# EAGLE design ArduBridge_V1_Alpha (EAGLE 6.4)
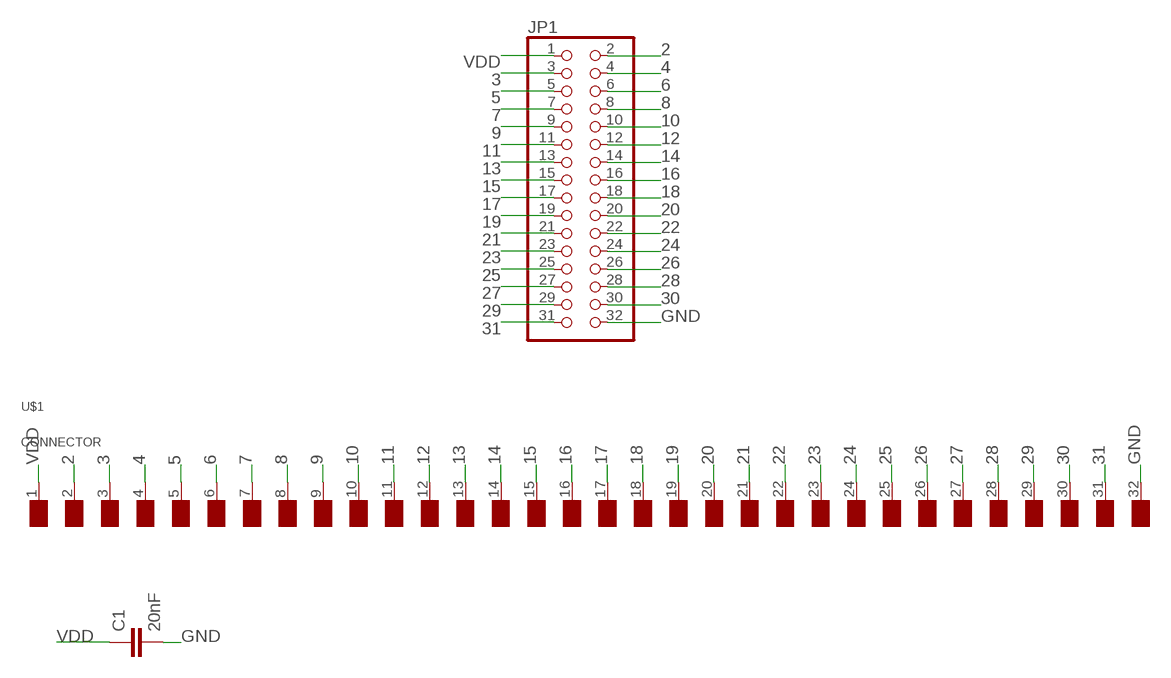
[diagram p0: schematic, sheet 1]

## Parts
C1  20nF  C-EUC0805  [C0805]
JP1  PINHD-2X16/90  [2X16/90]
U$1  CONNECTOR  [CONNECTOR]

## Nets
2: JP1.2 U$1.2(NC)
3: JP1.3 U$1.3(/WR)
4: JP1.4 U$1.4(/RD)
5: JP1.5 U$1.5(/RCS)
6: JP1.6 U$1.6(A0)
7: JP1.7 U$1.7(A1)
8: JP1.8 U$1.8(A2)
9: JP1.9 U$1.9(A3)
10: JP1.10 U$1.10(A4)
11: JP1.11 U$1.11(A5)
12: JP1.12 U$1.12(A6)
13: JP1.13 U$1.13(A7)
14: JP1.14 U$1.14(A8)
15: JP1.15 U$1.15(A9)
16: JP1.16 U$1.16(A10)
17: JP1.17 U$1.17(A11)
18: JP1.18 U$1.18(A12)
19: JP1.19 U$1.19(A13)
20: JP1.20 U$1.20(A14)
21: JP1.21 U$1.21(A15)
22: JP1.22 U$1.22(D0)
23: JP1.23 U$1.23(D1)
24: JP1.24 U$1.24(D2)
25: JP1.25 U$1.25(D3)
26: JP1.26 U$1.26(D4)
27: JP1.27 U$1.27(D5)
28: JP1.28 U$1.28(D6)
29: JP1.29 U$1.29(D7)
30: JP1.30 U$1.30(/RS)
31: JP1.31 U$1.31(VIN)
GND: C1.2 JP1.32 U$1.32(GND)
VDD: C1.1 JP1.1 U$1.1(VDD)

## Library data of the parts
C1 = resistor:C-EU: CAPACITOR, European symbol
JP1 = pinhead:PINHD-2X16: PIN HEADER
U$1 = gameboy:CONNECTOR: Connector Pads for Gameboy Cartridges

## Board
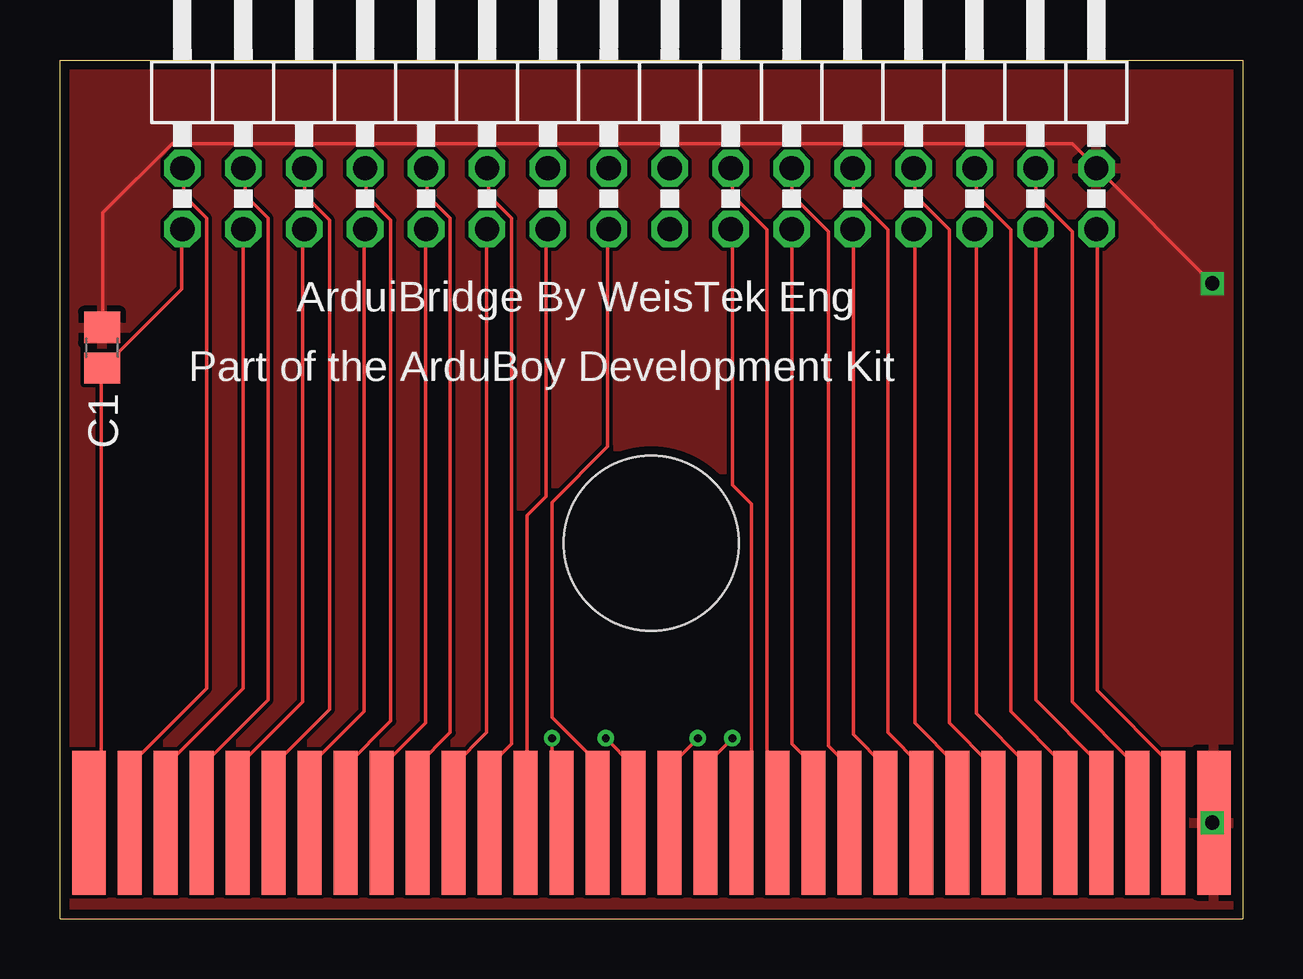
[diagram p1: board, top side]
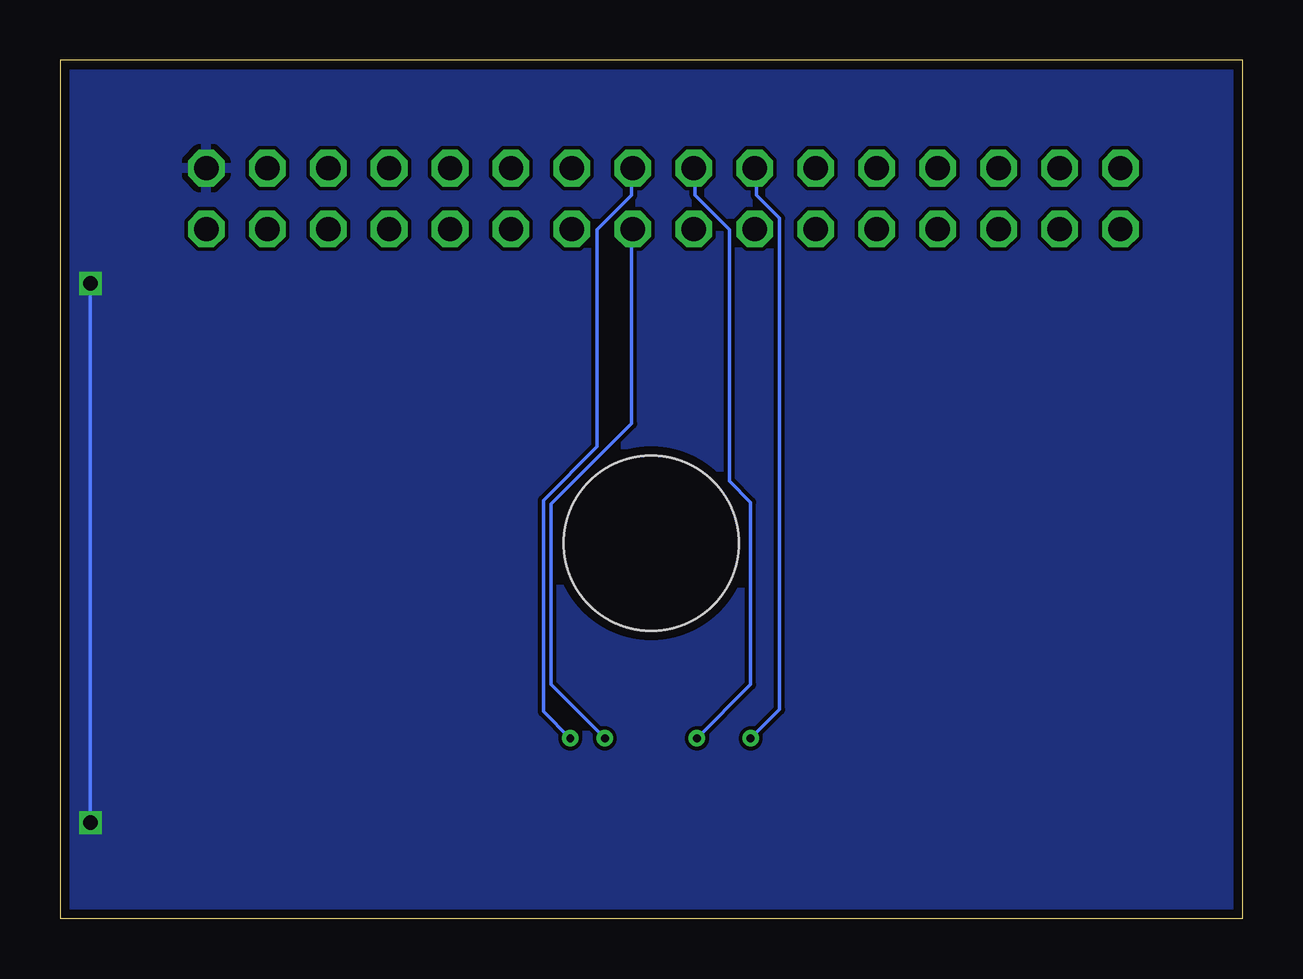
[diagram p2: board, bottom side, seen from below]

Size 49.3 x 35.8 mm. Coordinates in mm from the lower left corner, seen from the top.
Outline: 49.3,35.8 49.3,0 0,0 0,35.8 49.3,35.8
Copper layers (1*16): Top 0.0356mm / dielectric 1.5011mm / Bottom 0.0356mm
Design rules "oshpark-2layer": minimum track width 6mil, minimum drill 13mil, track to track 6mil, track to pad 6mil, pad to pad 6mil, via to via 6mil, smd to smd 6mil, copper to edge 15mil, drill to drill 6mil, minimum pad ring 7mil, minimum via ring 7mil, stop-mask expansion 4mil, vias tented up to drill 0mil, thermal gap 10mil
Holes 7.3 mm at 24.65,15.65

### Footprints (pad centres in the part's own frame; a part is rotated, then mirrored left to right if it is on the bottom)
C0805 = smd 1.3 x 1.5: 1 -0.85,0; 2 0.85,0
2X16/90 = drill 1.016 octagon: 1 -19.05,-6.35; 2 -19.05,-3.81; 3 -16.51,-6.35; 4 -16.51,-3.81; 5 -13.97,-6.35; 6 -13.97,-3.81; 7 -11.43,-6.35; 8 -11.43,-3.81; 9 -8.89,-6.35; 10 -8.89,-3.81; 11 -6.35,-6.35; 12 -6.35,-3.81; 13 -3.81,-6.35; 14 -3.81,-3.81; 15 -1.27,-6.35; 16 -1.27,-3.81; 17 1.27,-6.35; 18 1.27,-3.81; 19 3.81,-6.35; 20 3.81,-3.81; 21 6.35,-6.35; 22 6.35,-3.81; 23 8.89,-6.35; 24 8.89,-3.81; 25 11.43,-6.35; 26 11.43,-3.81; 27 13.97,-6.35; 28 13.97,-3.81; 29 16.51,-6.35; 30 16.51,-3.81; 31 19.05,-6.35; 32 19.05,-3.81
CONNECTOR = smd 1.4 x 6: 1 0.7,-3; 32 47.6,-3 | smd 1 x 6: 2 2.4,-3; 3 3.9,-3; 4 5.4,-3; 5 6.9,-3; 6 8.4,-3; 7 9.9,-3; 8 11.4,-3; 9 12.9,-3; 10 14.4,-3; 11 15.9,-3; 12 17.4,-3; 13 18.9,-3; 14 20.4,-3; 15 21.9,-3; 16 23.4,-3; 17 24.9,-3; 18 26.4,-3; 19 27.9,-3; 20 29.4,-3; 21 30.9,-3; 22 32.4,-3; 23 33.9,-3; 24 35.4,-3; 25 36.9,-3; 26 38.4,-3; 27 39.9,-3; 28 41.4,-3; 29 42.9,-3; 30 44.4,-3; 31 45.9,-3

### Placement (x,y rotation side)
C1  1.75,23.8 90 top
JP1  24.15,35.1 0 top
U$1  0.5,7 0 top

### Tracks (layer width: path | path; a pad name or v marks a point on that pad's centre or on a via)
2
  Top 0.152: JP1.2 5.15,31.28 5.15,30.16 6.11,29.2 6.11,9.6 2.91,6.4 U$1.2
3
  Top 0.152: JP1.3 7.63,28.72 7.63,9.6 4.43,6.4 4.43,4 U$1.3
4
  Top 0.152: JP1.4 7.71,31.28 7.71,30.16 8.67,29.2 8.67,9.12 5.95,6.4 5.95,4 U$1.4
5
  Top 0.152: JP1.5 10.11,28.72 10.11,9.04 7.47,6.4 7.47,4 U$1.5
6
  Top 0.152: JP1.6 10.19,30.16 11.23,29.12 11.23,8.72 8.91,6.4 U$1.6
7
  Top 0.152: JP1.7 12.67,28.72 12.67,8.64 10.43,6.4 10.43,4 U$1.7
8
  Top 0.152: JP1.8 12.75,31.28 12.75,30.16 13.79,29.12 13.79,8.24 11.95,6.4 11.95,4 U$1.8
9
  Top 0.152: JP1.9 15.23,28.72 15.23,8.16 13.47,6.4 13.47,4 U$1.9
10
  Top 0.152: JP1.10 15.31,31.28 15.31,30.16 16.27,29.2 16.27,7.76 14.91,6.4 U$1.10
11
  Top 0.152: JP1.11 17.79,28.72 17.79,7.76 16.43,6.4 16.43,4 U$1.11
12
  Top 0.152: JP1.12 17.87,31.28 17.87,30.16 18.83,29.2 18.83,7.28 17.95,6.4 17.95,4 U$1.12
13
  Top 0.152: JP1.13 20.27,28.72 20.27,17.6 19.47,16.8 19.47,4 U$1.13
14  (via drill 0.33)
  Top 0.152: v20.51,7.52 20.51,4.32 20.83,4 U$1.14
  Bottom 0.152: v20.51,7.52 19.31,8.72 19.31,29.2 20.27,30.16 20.27,31.28 JP1.14
15
  Top 0.152: JP1.15 22.83,28.72 22.83,19.68 20.51,17.36 20.51,8.4 22.35,6.56 22.35,4 U$1.15
16  (via drill 0.33)
  Top 0.152: v22.75,7.52 23.87,6.4 23.87,4 U$1.16
  Bottom 0.152: v22.75,7.52 20.51,9.76 20.51,17.36 21.39,18.24 21.39,28.72 22.83,30.16 22.83,31.28 JP1.16
17  (via drill 0.33)
  Top 0.152: v26.59,7.52 25.47,6.4 25.47,4 U$1.17
  Bottom 0.152: v26.59,7.52 28.83,9.76 28.83,17.28 25.47,20.64 25.47,28.72 JP1.17
18  (via drill 0.33)
  Top 0.152: v28.03,7.52 26.91,6.4 U$1.18
  Bottom 0.152: v28.03,7.52 29.15,8.64 29.15,17.44 26.91,19.68 26.91,28.72 25.47,30.16 25.47,31.28 JP1.18
19
  Top 0.152: JP1.19 28.03,28.72 28.03,18.08 28.83,17.28 28.83,4.4 28.43,4 U$1.19
20
  Top 0.152: JP1.20 28.03,31.28 28.03,30.16 29.47,28.72 29.47,4.4 29.87,4 U$1.20
21
  Top 0.152: JP1.21 30.51,28.72 30.51,7.28 31.39,6.4 U$1.21
22
  Top 0.152: JP1.22 30.51,30.16 32.03,28.64 32.03,7.2 32.83,6.4 32.83,4 U$1.22
23
  Top 0.152: JP1.23 33.07,28.72 33.07,7.68 34.35,6.4 34.35,4 U$1.23
24
  Top 0.152: JP1.24 33.07,31.28 33.07,30.16 34.51,28.72 34.51,7.76 35.87,6.4 35.87,4 U$1.24
25
  Top 0.152: JP1.25 35.63,28.72 35.63,8.16 37.39,6.4 U$1.25
26
  Top 0.152: JP1.26 35.63,31.28 35.63,30.16 37.07,28.72 37.07,8.16 38.83,6.4 38.83,4 U$1.26
27
  Top 0.152: JP1.27 38.19,28.72 38.19,8.56 40.35,6.4 40.35,4 U$1.27
28
  Top 0.152: JP1.28 38.19,31.28 38.19,30.16 39.63,28.72 39.63,8.64 41.87,6.4 41.87,4 U$1.28
29
  Top 0.152: JP1.29 40.67,28.72 40.67,9.12 43.39,6.4 U$1.29
30
  Top 0.152: JP1.30 40.67,30.16 42.19,28.64 42.19,9.04 44.83,6.4 44.83,4 U$1.30
31
  Top 0.152: JP1.31 43.23,28.72 43.23,9.52 46.35,6.4 46.35,4 U$1.31
GND  (via drill 0.6)
  Top 0.152: C1.2 1.79,24.72 1.79,29.44 4.67,32.32 42.19,32.32 43.15,31.36 JP1.32 43.23,31.28 v48.03,26.48 | v48.03,4 U$1.32
  Bottom 0.152: v48.03,26.48 v48.03,4
  pour Top (isolate 0.012): -1.15,37.7 51.25,37.7 51.25,-1.9 -1.15,-1.9
  pour Bottom (isolate 0.012): -1.25,37.6 51.75,37.6 51.75,-1.8 -1.25,-1.8
VDD
  Top 0.152: JP1.1 5.07,28.72 5.07,26.24 1.79,22.96 C1.1 1.71,22.88 1.71,4.48 1.23,4 U$1.1

### Text on the board
tPlace: ArduiBridge By WeisTek Eng | Part of the ArduBoy Development Kit
tStop: ArduCart Bridge V1 Alpha